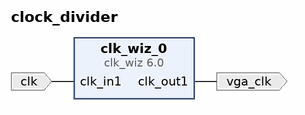
[diagram p0: block diagram of the top level]
# Vivado block design clock_divider, xc7a35tcsg324-2L, Vivado 2021.1
create_bd_design clock_divider

create_bd_port -dir I -type clk clk
create_bd_port -dir O -type clk vga_clk

create_bd_cell -type ip -vlnv xilinx.com:ip:clk_wiz:6.0 clk_wiz_0
set_property -dict [list \
  CONFIG.CLKOUT1_JITTER 181.828 \
  CONFIG.CLKOUT1_PHASE_ERROR 104.359 \
  CONFIG.CLKOUT1_REQUESTED_OUT_FREQ 25 \
  CONFIG.MMCM_CLKFBOUT_MULT_F 9.125 \
  CONFIG.MMCM_CLKOUT0_DIVIDE_F 36.500 \
  CONFIG.USE_LOCKED false \
  CONFIG.USE_RESET false \
] [get_bd_cells clk_wiz_0]

# ---- connections ----

connect_bd_net -net clk_in1_0_1 [get_bd_ports clk] [get_bd_pins clk_wiz_0/clk_in1]
connect_bd_net [get_bd_pins clk_wiz_0/clk_out1] [get_bd_ports vga_clk]

validate_bd_design
save_bd_design
